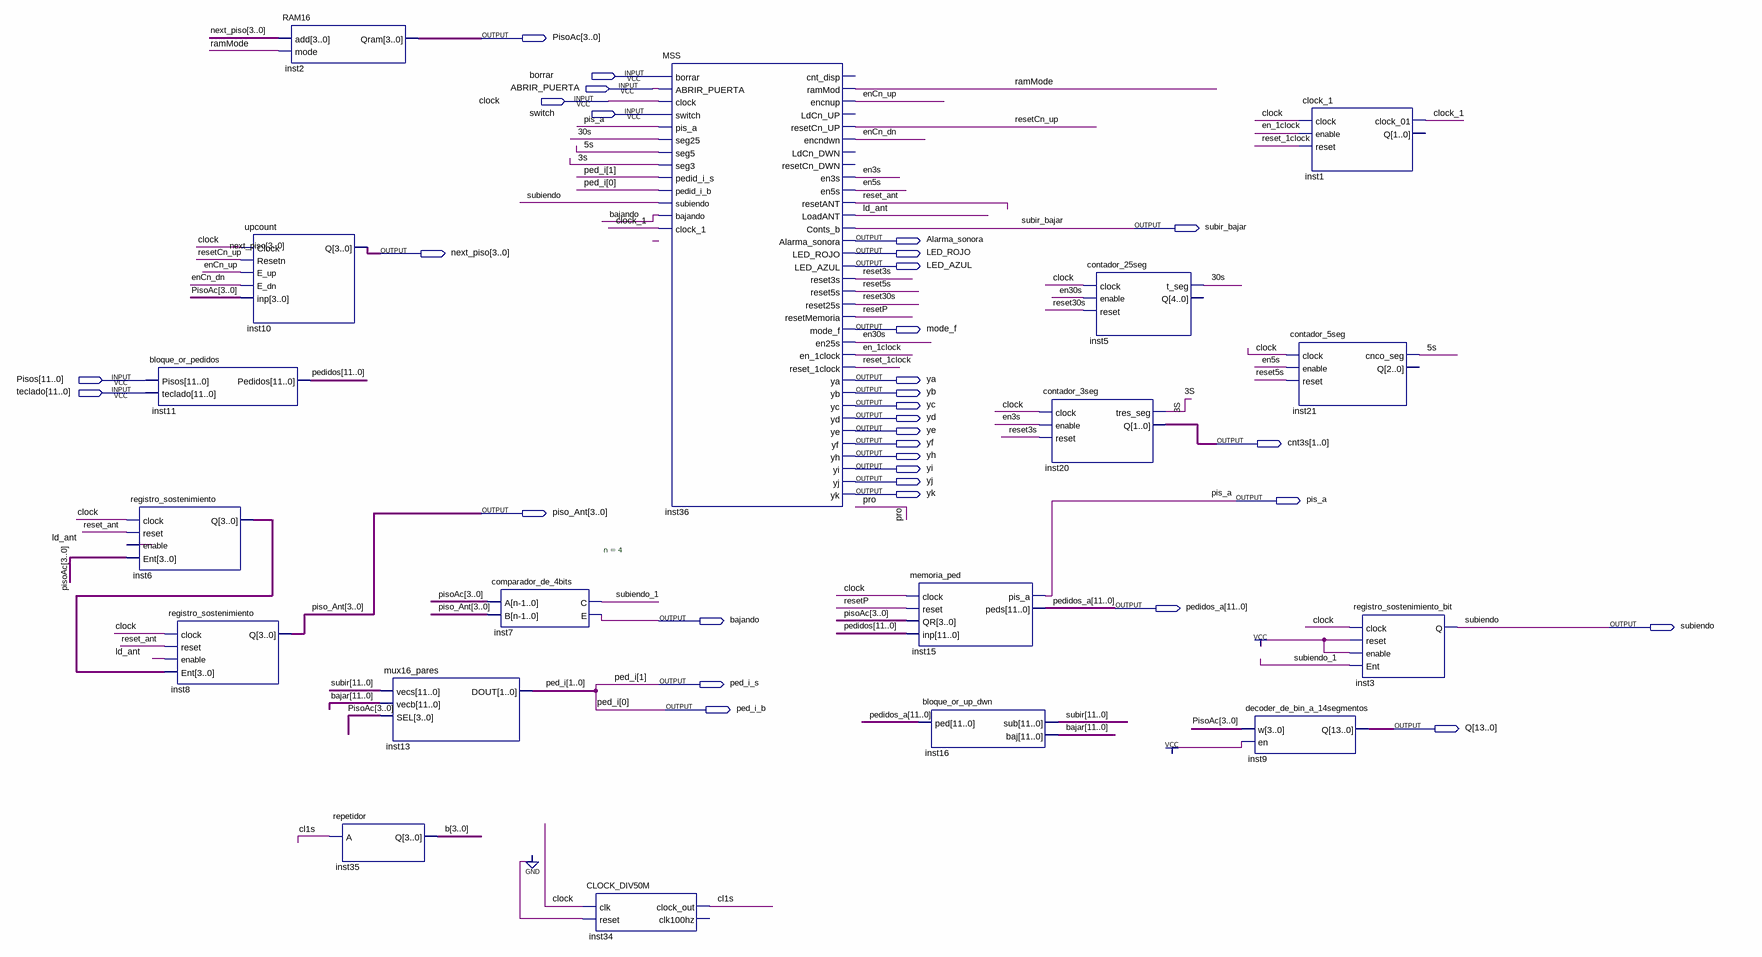
[diagram p0: schematic sheet]
// Quartus schematic mss1.bdf as structural Verilog: 18 symbols, 32 pins
module mss1 (
  input  borrar,
  input  ABRIR_PUERTA,
  input  clock,
  input  switch,
  input  [11:0] Pisos,
  input  [11:0] teclado,
  output [3:0] PisoAc,
  output subir_bajar,
  output Alarma_sonora,
  output [3:0] next_piso,
  output LED_ROJO,
  output LED_AZUL,
  output mode_f,
  output ya,
  output yb,
  output yc,
  output yd,
  output ye,
  output yf,
  output [1:0] cnt3s,
  output yh,
  output yi,
  output yj,
  output yk,
  output pis_a,
  output [3:0] piso_Ant,
  output [11:0] pedidos_a,
  output bajando,
  output subiendo,
  output ped_i_s,
  output ped_i_b,
  output [13:0] Q
);

  wire \3s , \5s , \30s , cl1s, clock_1, en3s, en5s, en30s, en_1clock, enCn_dn, enCn_up, ld_ant, ramMode,
       reset3s, reset5s, reset30s, reset_1clock, reset_ant, resetCn_up, resetP, subiendo_1;
  wire [3:0] b, inst6_q;
  wire [11:0] bajar, pedidos, subir;

  registro_sostenimiento inst6 (.clock(clock), .reset(reset_ant), .enable(ld_ant), .Ent(PisoAc), .Q(inst6_q));
  bloque_or_pedidos inst11 (.Pisos(Pisos), .teclado(teclado), .Pedidos(pedidos));
  registro_sostenimiento inst8 (.clock(clock), .reset(reset_ant), .enable(ld_ant), .Ent(inst6_q), .Q(piso_Ant));
  RAM16 inst2 (.add(next_piso), .mode(ramMode), .Qram(PisoAc));
  upcount inst10 (.Clock(clock), .Resetn(resetCn_up), .E_up(enCn_up), .E_dn(enCn_dn), .inp(PisoAc), .Q(next_piso));
  repetidor inst35 (.A(cl1s), .Q(b));
  mux16_pares inst13 (.vecs(subir), .vecb(bajar), .SEL(PisoAc), .DOUT({ped_i_s, ped_i_b}));
  comparador_de_4bits #(.n(4)) inst7 (.A(PisoAc), .B(piso_Ant), .C(subiendo_1), .E(bajando));
  CLOCK_DIV50M inst34 (.clk(clock), .reset(1'b0), .clock_out(cl1s));  // open: clk100hz
  MSS inst36 (
    .borrar(borrar), .ABRIR_PUERTA(ABRIR_PUERTA), .clock(clock), .switch(switch), .pis_a(pis_a),
    .seg25(\30s ), .seg5(\5s ), .seg3(\3s ), .pedid_i_s(ped_i_s), .pedid_i_b(ped_i_b), .subiendo(subiendo),
    .bajando(bajando), .clock_1(clock_1), .ramMod(ramMode), .encnup(enCn_up), .resetCn_UP(resetCn_up),
    .encndwn(enCn_dn), .en3s(en3s), .en5s(en5s), .resetANT(reset_ant), .LoadANT(ld_ant),
    .Conts_b(subir_bajar), .Alarma_sonora(Alarma_sonora), .LED_ROJO(LED_ROJO), .LED_AZUL(LED_AZUL),
    .reset3s(reset3s), .reset5s(reset5s), .reset25s(reset30s), .resetMemoria(resetP), .mode_f(mode_f),
    .en25s(en30s), .en_1clock(en_1clock), .reset_1clock(reset_1clock), .ya(ya), .yb(yb), .yc(yc), .yd(yd),
    .ye(ye), .yf(yf), .yh(yh), .yi(yi), .yj(yj), .yk(yk));  // open: cnt_disp, LdCn_UP, LdCn_DWN, resetCn_DWN
  memoria_ped inst15 (.clock(clock), .reset(resetP), .QR(PisoAc), .inp(pedidos), .pis_a(pis_a), .peds(pedidos_a));
  bloque_or_up_dwn inst16 (.ped(pedidos_a), .sub(subir), .baj(bajar));
  contador_3seg inst20 (.clock(clock), .enable(en3s), .reset(reset3s), .tres_seg(\3s ), .Q(cnt3s));
  contador_25seg inst5 (.clock(clock), .enable(en30s), .reset(reset30s), .t_seg(\30s ));  // open: Q
  decoder_de_bin_a_14segmentos inst9 (.w(PisoAc), .en(1'b1), .Q(Q));
  contador_5seg inst21 (.clock(clock), .enable(en5s), .reset(reset5s), .cnco_seg(\5s ));  // open: Q
  clock_1 inst1 (.clock(clock), .enable(en_1clock), .reset(reset_1clock), .clock_01(clock_1));  // open: Q
  registro_sostenimiento_bit inst3 (.clock(clock), .reset(1'b1), .enable(1'b1), .Ent(subiendo_1), .Q(subiendo));

  // Other names for the same wires on the sheet: ped_i[1:0] = {ped_i_s, ped_i_b}
endmodule
